# Altium schematic sheet Arak-AnalogueFrontend.SchDoc
size 431 x 279 mm; Date: Not shown in title block; ApprovedBy: Not shown in title block; CheckedBy: Not shown in title block; Author: Not shown in title block; CompanyName: Not shown in title block; Engineer: Not shown in title block; Organization: Not shown in title block; Address1: Not shown in title block; Address2: Not shown in title block; Address3: Not shown in title block; Address4: Not shown in title block; DocumentNumber: 6; Revision: Use project parameter SCH_Rev; SheetNumber: 6; SheetTotal: 11; PageSetup: Record=PageOptions|CenterHorizontal=True|CenterVertical=True|PrintScale=1.00|XCorrection=1.00|YCorrection=1.00|PrintKind=0|BorderSize=5000000|LeftOffset=0|BottomOffset=0|Orientation=2|PaperLength=1000|PaperWidth=1000|Scale=100|PaperSource=15|PrintQuality=600|MediaType=1|DitherType=10|PaperKind=Letter|PrintScaleMode=1; CurrentTime: Not shown in title block; CurrentDate: Not shown in title block; Time: Not shown in title block; DocumentFullPathAndName: Not shown in title block; DocumentName: Not shown in title block; ModifiedDate: Not shown in title block; ImagePath: Not shown in title block
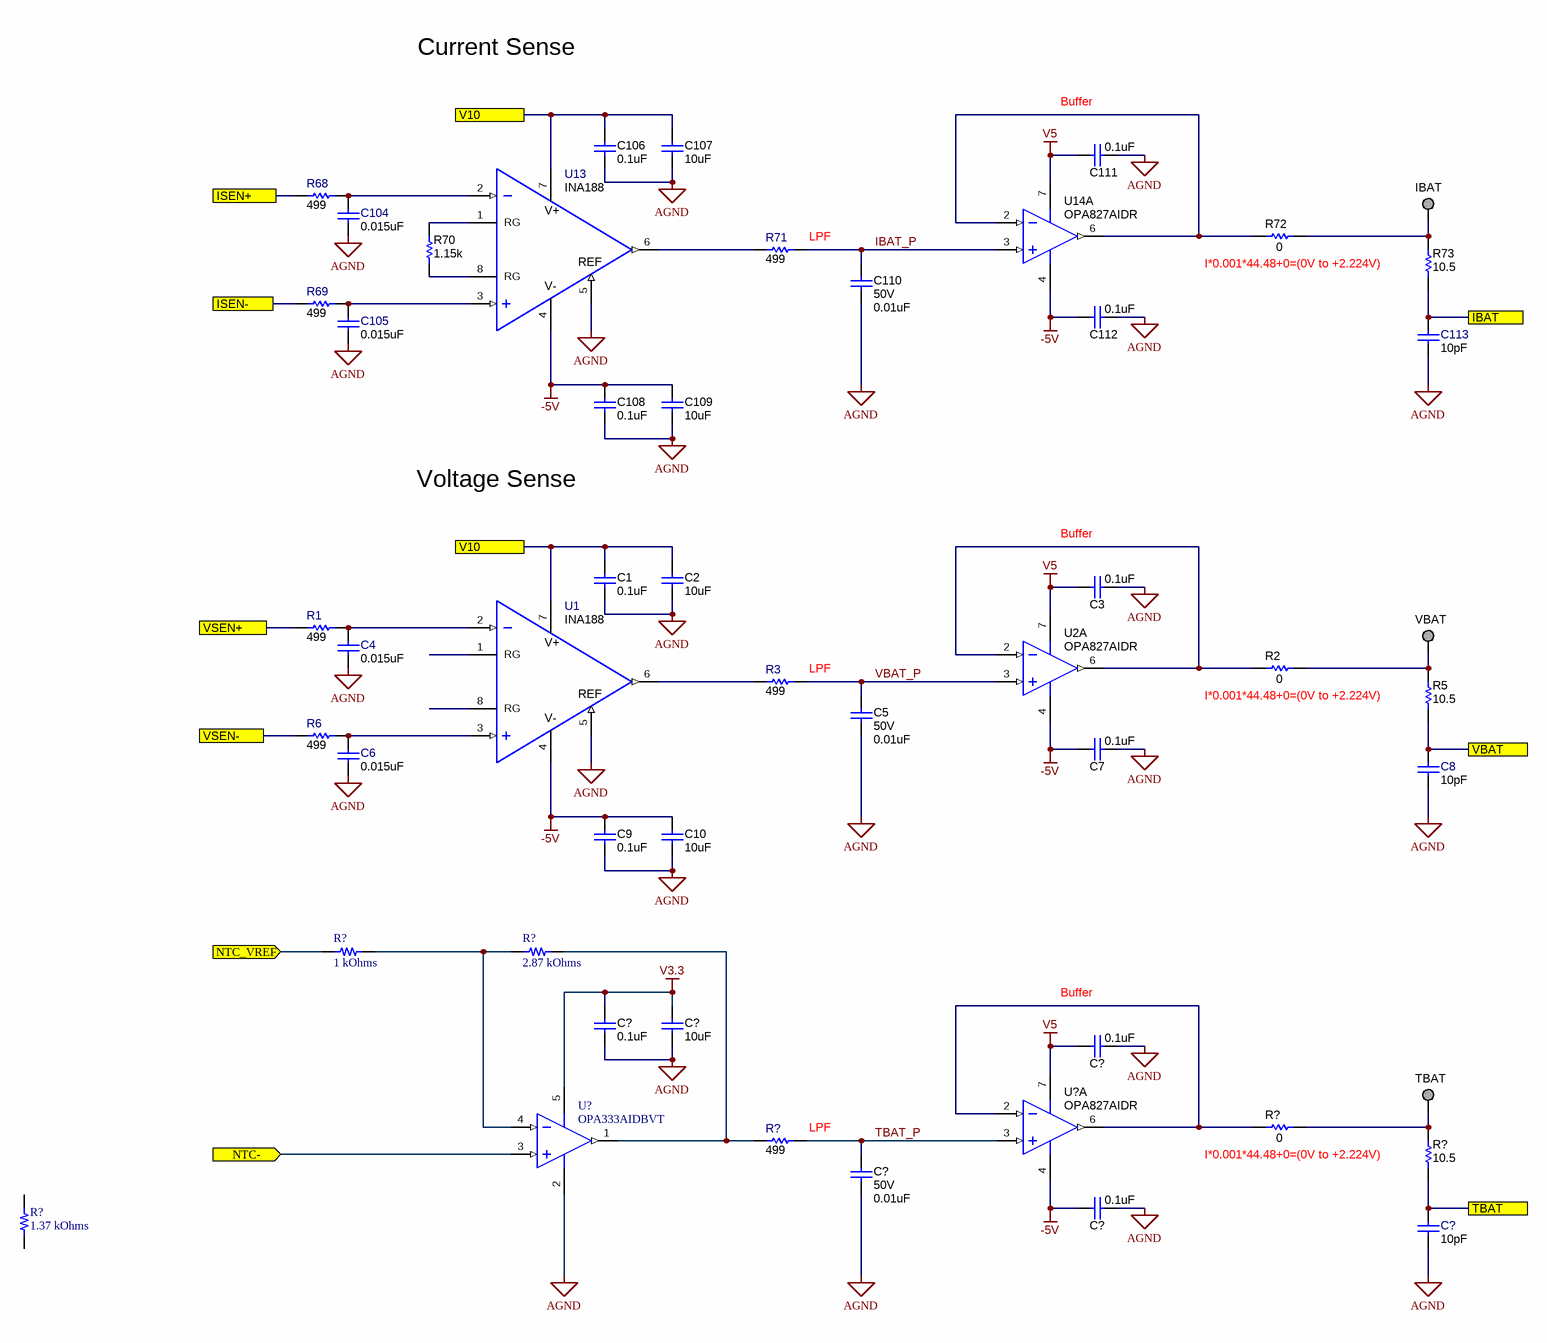
[diagram p0: Arak-AnalogueFrontend.SchDoc]

## Parts
(Parts that share a designator on the sheet are numbered #1, #2 ... from top to bottom, then left to right.)
C1  ValueDisplayed: 0.1uF  [0603]  (hidden comment: Capacitor)
C2  ValueDisplayed: 10uF  [0805_HV]  (hidden comment: Capacitor)
C3  ValueDisplayed: 0.1uF  [0603]  (hidden comment: Capacitor)
C4  ValueDisplayed: 0.015uF  [0603]  (hidden comment: Capacitor)
C5  VDC_V: 50V  ValueDisplayed: 0.01uF  [0603]  (hidden comment: GCM188R71H103KA37D)
C6  ValueDisplayed: 0.015uF  [0603]  (hidden comment: Capacitor)
C7  ValueDisplayed: 0.1uF  [0603]  (hidden comment: Capacitor)
C8  ValueDisplayed: 10pF  [0603]  (hidden comment: Capacitor)
C9  ValueDisplayed: 0.1uF  [0603]  (hidden comment: Capacitor)
C10  ValueDisplayed: 10uF  [0805_HV]  (hidden comment: Capacitor)
C104  ValueDisplayed: 0.015uF  [0603]  (hidden comment: Capacitor)
C105  ValueDisplayed: 0.015uF  [0603]  (hidden comment: Capacitor)
C106  ValueDisplayed: 0.1uF  [0603]  (hidden comment: Capacitor)
C107  ValueDisplayed: 10uF  [0805_HV]  (hidden comment: Capacitor)
C108  ValueDisplayed: 0.1uF  [0603]  (hidden comment: Capacitor)
C109  ValueDisplayed: 10uF  [0805_HV]  (hidden comment: Capacitor)
C110  VDC_V: 50V  ValueDisplayed: 0.01uF  [0603]  (hidden comment: GCM188R71H103KA37D)
C111  ValueDisplayed: 0.1uF  [0603]  (hidden comment: Capacitor)
C112  ValueDisplayed: 0.1uF  [0603]  (hidden comment: Capacitor)
C113  ValueDisplayed: 10pF  [0603]  (hidden comment: Capacitor)
C?#1  ValueDisplayed: 0.1uF  [0603]  (hidden comment: Capacitor)
C?#2  ValueDisplayed: 10uF  [0805_HV]  (hidden comment: Capacitor)
C?#3  ValueDisplayed: 0.1uF  [0603]  (hidden comment: Capacitor)
C?#4  VDC_V: 50V  ValueDisplayed: 0.01uF  [0603]  (hidden comment: GCM188R71H103KA37D)
C?#5  ValueDisplayed: 0.1uF  [0603]  (hidden comment: Capacitor)
C?#6  ValueDisplayed: 10pF  [0603]  (hidden comment: Capacitor)
IBAT  Pogo Pad  [PogoPad]  (value not drawn)  (no BOM)
R1  ValueDisplayed: 499  [0603]  (hidden comment: Resistor)
R2  ValueDisplayed: 0  [0603]  (hidden comment: Resistor)
R3  ValueDisplayed: 499  [0603]  (hidden comment: Resistor)
R5  ValueDisplayed: 10.5  [0603]  (hidden comment: RC0603FR-0710R5L)
R6  ValueDisplayed: 499  [0603]  (hidden comment: Resistor)
R68  ValueDisplayed: 499  [0603]  (hidden comment: Resistor)
R69  ValueDisplayed: 499  [0603]  (hidden comment: Resistor)
R70  1.15k  [0603]
R71  ValueDisplayed: 499  [0603]  (hidden comment: Resistor)
R72  ValueDisplayed: 0  [0603]  (hidden comment: Resistor)
R73  ValueDisplayed: 10.5  [0603]  (hidden comment: RC0603FR-0710R5L)
R?#1  1 kOhms  [RES 0603_1608]
R?#2  2.87 kOhms  [RES 0603_1608]
R?#3  ValueDisplayed: 0  [0603]  (hidden comment: Resistor)
R?#4  ValueDisplayed: 499  [0603]  (hidden comment: Resistor)
R?#5  ValueDisplayed: 10.5  [0603]  (hidden comment: RC0603FR-0710R5L)
R?#6  1.37 kOhms  [RES 0603_1608]
TBAT  Pogo Pad  [PogoPad]  (value not drawn)  (no BOM)
U1  INA188  [D0008A_N]
U2  OPA827AIDR  [D0008A_L]  (part A of 2)
U13  INA188  [D0008A_N]
U14  OPA827AIDR  [D0008A_L]  (part A of 2)
U?#1  OPA827AIDR  [D0008A_L]  (part A of 2)
U?#2  OPA333AIDBVT  [DBV0005A_M]
VBAT  Pogo Pad  [PogoPad]  (value not drawn)  (no BOM)

## Ports
IBAT, ISEN+, ISEN-, NTC- (in), NTC_VREF (in), TBAT, V10, VBAT, VSEN+, VSEN-

## Nets
-5V: C7.1 C9.1 C10.1 C108.1 C109.1 C112.1 C?#5.1 U1.4(V-) U2.4(V-) U13.4(V-) U14.4(V-) U?#1.4(V-)
AGND: C1.2 C2.2 C3.2 C4.2 C5.2 C6.2 C7.2 C8.1 C9.2 C10.2 C104.2 C105.2 C106.2 C107.2 C108.2 C109.2 C110.2 C111.2 C112.2 C113.1 C?#1.2 C?#2.2 C?#3.2 C?#4.2 C?#5.2 C?#6.1 U1.5(REF) U13.5(REF) U?#2.2(V-)
V3.3: C?#1.1 C?#2.1 U?#2.5(V+)
V5: C3.1 C111.1 C?#3.1 U2.7(V+) U14.7(V+) U?#1.7(V+)
IBAT: C113.2 R73.1 ; port IBAT
IBAT_P: C110.1 R71.1 U14.3(IN+)
ISEN+: R68.2 ; port ISEN+
ISEN-: R69.2 ; port ISEN-
NTC-: U?#2.3(IN+) ; port NTC-
NTC_VREF: R?#1.1 ; port NTC_VREF
TBAT: C?#6.2 R?#5.1 ; port TBAT
TBAT_P: C?#4.1 R?#4.1 U?#1.3(IN+)
V10: C1.1 C2.1 C106.1 C107.1 U1.7(V+) U13.7(V+) ; port V10
VBAT: C8.2 R5.1 ; port VBAT
VBAT_P: C5.1 R3.1 U2.3(IN+)
VSEN+: R1.2 ; port VSEN+
VSEN-: R6.2 ; port VSEN-
NetC4_1: C4.1 R1.1 U1.2(IN-)
NetC6_1: C6.1 R6.1 U1.3(IN+)
NetC104_1: C104.1 R68.1 U13.2(IN-)
NetC105_1: C105.1 R69.1 U13.3(IN+)
NetIBAT_1: IBAT.1 R72.2 R73.2
NetR2_1: R2.1 U2.2(IN-) U2.6(OUT)
NetR2_2: R2.2 R5.2 VBAT.1
NetR3_2: R3.2 U1.6(OUT)
NetR70_1: R70.1 U13.8(RG)
NetR70_2: R70.2 U13.1(RG)
NetR71_2: R71.2 U13.6(OUT)
NetR72_1: R72.1 U14.2(IN-) U14.6(OUT)
NetR?#1_2: R?#1.2 R?#2.1 U?#2.4(IN-)
NetR?#2_2: R?#2.2 R?#4.2 U?#2.1(OUT)
NetR?#3_1: R?#3.1 U?#1.2(IN-) U?#1.6(OUT)
NetR?#3_2: R?#3.2 R?#5.2 TBAT.1

Not connected (* = marked no-connect by the designer): R?#6 1 2; U1 1(RG) 8(RG)

## Notes on the sheet
- Current Sense
- (near C111) Buffer
- (near R71) LPF
- (near R72) I*0.001*44.48+0=(0V to +2.224V)
- Voltage Sense
- (near C3) Buffer
- (near R3) LPF
- (near R2) I*0.001*44.48+0=(0V to +2.224V)
- (near C?#3) Buffer
- (near R?#4) LPF
- (near R?#3) I*0.001*44.48+0=(0V to +2.224V)
- Drawn By:
- SVN Rev:
- Number:
- TID #:
- Orderable:
- Rev:
- Sheet Title:
- File:
- Project Title:
- Designed for:
- Assembly Variant:
- Mod. Date:
- Sheet:
- Size:
- of
- B
- http://www.ti.com
- Texas Instruments and/or its licensors do not warrant the accuracy or completeness of this specification or any information contained therein. Texas Instruments and/or its licensors do not warrant that this design will meet the specifications, will be suitable for your application or fit for any particular purpose, or will operate in an implementation. Texas Instruments and/or its licensors do not warrant that the design is production worthy. You should completely validate and test your design implementation to confirm the system functionality for your application.
- Engineer:
- Contact:
- © Texas Instruments

## Library data of the parts
C1 C3 C7 C9 C106 C108 C111 C112 C?#1 C?#3 C?#5 = CMP-0006752-5: CAP, CERM, 0.1 uF, 25 V, +/- 5%, X7R, 0603; PartNumber: 06033C104JAT2A; Manufacturer: AVX; Polarized: N; Value: 0.1uF; U/M: EA; Cap_F: 100nF; ESR_ohm: 0.05; Value1: 0.05 ohm; VDC_V: 25V; TaMin_C: -55°C; TaMax_C: 125°C; AEC Category: Q200; SizeArea_mm2: 1.28; SizeAreaWB_mm2: 4.68; SizeX_mm: 1.6; SizeY_mm: 0.8; SizeZ_mm: 1; CompType: Capacitor; PackageReference: 0603; RoHS: Y; Tolerance_%: 5%; Value2: 25V; MountType: SMT; Technology: Ceramic; TempCo: X7R; Cap_Case: 0603; Published: 2008-06-19; Publisher: Texas Instruments; LatestRevisionDate: 2017-03-09; ComponentLink1Description: Datasheet link; ComponentLink1URL: http://datasheets.avx.com/X7RDielectric.pdf; Supplier 1: Digi-Key; Supplier Part Number 1: 478-3713-1-ND; Supplier 2: Mouser; Supplier Part Number 2: 581-06033C104JAT2A; Supplier 3: Farnell; Supplier Part Number 3: 1740614; AEC Qualified: N; AEC Grade: N/A
C2 C10 C107 C109 C?#2 = CMP-0008315-2: CAP, CERM, 10 uF, 10 V, +/- 10%, X7R, 0805; PartNumber: GRM21BR71A106KE51L; Manufacturer: MuRata; Polarized: N; Value: 10uF; U/M: EA; Cap_F: 10µF; ESR_ohm: 3m; Value1: 0.003 ohm; VDC_V: 10V; TaMin_C: -55°C; TaMax_C: 125°C; Cap_Case: 0805; AEC Category: Q200; SizeArea_mm2: 2.5; SizeAreaWB_mm2: 6.75; SizeX_mm: 2; SizeY_mm: 1.25; SizeZ_mm: 1.45; CompType: Capacitor; PackageReference: 0805; RoHS: Y; Tolerance_%: 10%; Value2: 10V; MountType: SMT; Technology: Ceramic; TempCo: X7R; Published: 2008-06-19; Publisher: Texas Instruments; LatestRevisionDate: 2017-03-09; ComponentLink1Description: Datasheet link; ComponentLink1URL: http://search.murata.co.jp/Ceramy/PnsearchViewAction.do?HnOFG=ON&HnNFG=ON&SEL_CNT=50&sLang=en&sKey=GRM21BR71A106KE51L&x=9&y=9&search=startwith; Supplier 1: Digi-Key; Supplier Part Number 1: 490-3905-1-ND; Supplier 2: Mouser; Supplier Part Number 2: 81-GRM21BR71A106KE51; Supplier 3: Farnell; Supplier Part Number 3: 1828828; AEC Qualified: ?
C4 C6 C104 C105 = CMP-0007383-5: CAP, CERM, 0.015 uF, 16 V, +/- 10%, X7R, 0603; PartNumber: GRM188R71C153KA01D; Manufacturer: MuRata; Polarized: N; U/M: EA; Cap_F: 15nF; Value1: Unknown; VDC_V: 16V; TaMin_C: -55°C; TaMax_C: 125°C; SizeArea_mm2: 1.28; SizeAreaWB_mm2: 4.68; SizeX_mm: 1.6; SizeY_mm: 0.8; SizeZ_mm: 1; AEC Category: Q200; CompType: Capacitor; Value: 0.015uF; PackageReference: 0603; RoHS: Y; Tolerance_%: 10%; Value2: 16V; MountType: SMT; Technology: Ceramic; TempCo: X7R; Cap_Case: 0603; Published: 2008-06-19; Publisher: Texas Instruments; LatestRevisionDate: 2017-03-09; ComponentLink1Description: Datasheet link; ComponentLink1URL: http://search.murata.co.jp/Ceramy/PnsearchViewAction.do?HnOFG=ON&HnNFG=ON&SEL_CNT=50&sLang=en&sKey=GRM188R71C153KA01D&x=9&y=9&search=startwith; Supplier 1: Mouser; Supplier Part Number 1: 81-GRM188R71C153KA; AEC Qualified: ?
C5 C110 C?#4 = CMP-0007143-4: CAP, CERM, 0.01 uF, 50 V, +/- 10%, X7R, AEC-Q200 Grade 1, 0603; Manufacturer: MuRata; TaMin_C: -55°C; Polarized: N; SizeAreaWB_mm2: 4.68; Value1: Unknown; U/M: EA; Value: 0.01uF; TaMax_C: 125°C; SizeZ_mm: 1; SizeX_mm: 1.6; SizeY_mm: 0.8; SizeArea_mm2: 1.28; CompType: Capacitor; AEC Qualified: Y; Cap_F: 10nF; AEC Category: Q200; Supplier Part Number 2: 45Y5166; Publisher: Texas Instruments; Supplier 2: Newark; Supplier Part Number 3: 81-GCM188R71H103KA7D; TempCo: X7R; Supplier 3: Mouser; Published: 2008-06-19; RoHS: Y; MountType: SMT; Supplier 1: Digi-Key; PackageReference: 0603; Tolerance_%: 10%; Cap_Case: 0603; Value2: 50V; LatestRevisionDate: 2017-03-09; PartNumber: GCM188R71H103KA37D; ComponentLink1Description: Datasheet link; AEC Grade: 1; Supplier Part Number 1: 490-4778-1-ND; Technology: Ceramic; ComponentLink1URL: http://psearch.en.murata.com/capacitor/product/GCM188R71H103KA37%23.pdf
C8 C113 C?#6 = CMP-0007170-4: CAP, CERM, 10 pF, 50 V, +/- 5%, C0G/NP0, 0603; PartNumber: GRM1885C1H100JA01D; Manufacturer: MuRata; Polarized: N; Value: 10pF; U/M: EA; Value1: Unknown; VDC_V: 50V; TaMin_C: -55°C; TaMax_C: 125°C; SizeArea_mm2: 1.28; SizeAreaWB_mm2: 4.68; SizeX_mm: 1.6; SizeY_mm: 0.8; SizeZ_mm: 1; AEC Category: Q200; CompType: Capacitor; PackageReference: 0603; RoHS: Y; Cap_F: 10pF; Tolerance_%: 5%; Value2: 50V; MountType: SMT; Technology: Ceramic; TempCo: C0G/NP0; Cap_Case: 0603; Published: 2008-06-19; Publisher: Texas Instruments; LatestRevisionDate: 2017-03-09; ComponentLink1Description: Datasheet link; ComponentLink1URL: http://search.murata.co.jp/Ceramy/PnsearchViewAction.do?HnOFG=ON&HnNFG=ON&SEL_CNT=50&sLang=en&sKey=GRM1885C1H100JA01D&x=9&y=9&search=startwith; Supplier 1: Digi-Key; Supplier Part Number 1: 490-1403-1-ND; Supplier 2: Mouser; Supplier Part Number 2: 81-GRM39C100D50; Supplier 3: Farnell; Supplier Part Number 3: 8819815; AEC Qualified: ?
IBAT TBAT VBAT = PogoPad: Pad for Pogo Pin Connector; SymbolCreator: codlsc; SymbolVersion: 2010-09-27; PackageReference: N/A; CompType: Pogo Pad; Publisher: Texas Instruments; LatestRevisionDate: 2016-12-05; LatestRevisionNote: Added Alternate PartNumber and Alternate Manufacturer parameters to appropriate components.
R1 R3 R6 R68 R69 R71 R?#4 = CMP-0022446-5: RES, 499, 1%, 0.1 W, AEC-Q200 Grade 0, 0603; PartNumber: CRCW0603499RFKEA; Manufacturer: Vishay-Dale; Value: 499; Value_Code: 499R; Power_W: 100mW; Value2: 0.1W; VDC_V: 75V; TempCo: 100 ppm/C; SizeArea_mm2: 1.28; SizeX_mm: 1.6; SizeY_mm: 0.8; SizeZ_mm: 1; EIA_Code: E96; AEC Category: Q200; AEC Qualified: Y; AEC Grade: 0; CompType: Resistor; PackageReference: 0603; RoHS: E; Res_ohm: 499; Tolerance_%: 1%; Value1: 1%; MountType: SMT; Technology: Thick Film; ComponentLink1Description: Datasheet link; ComponentLink1URL: http://www.vishay.com/docs/20035/dcrcwe3.pdf; Supplier 1: Digi-Key; Supplier Part Number 1: 541-499HCT-ND; Supplier 2: Newark; Supplier Part Number 2: 52K8569; Supplier 3: Mouser; Supplier Part Number 3: 71-CRCW0603-499-E3
R2 R72 R?#3 = CMP-0025874-3: RES, 0, 5%, 0.1 W, 0603; PartNumber: ERJ-3GEY0R00V; Manufacturer: Panasonic; Value: 0; Value_Code: 0000; Power_W: 100mW; Value2: 0.1W; VDC_V: 50V; TempCo: 600 ppm/C; EIA_Code: E24; U/M: EA; AEC Category: Q200; SizeArea_mm2: 1.28; SizeX_mm: 1.6; SizeY_mm: 0.8; SizeZ_mm: 1; CompType: Resistor; PackageReference: 0603; RoHS: Y; Res_ohm: 0; Tolerance_%: 5%; Value1: 5%; MountType: SMT; Technology: Thick Film; Published: 2008-06-26; Publisher: Texas Instruments; LatestRevisionDate: 2017-03-09; ComponentLink1Description: Datasheet link; ComponentLink1URL: http://www.panasonic.com/industrial/components/pdf/AOA0000CE1.pdf; Supplier 1: Digi-Key; Supplier Part Number 1: P0.0GCT-ND; Supplier 2: Mouser; Supplier Part Number 2: 667-ERJ-3GEY0R00V; Supplier 3: Farnell; Supplier Part Number 3: 2059527; AEC Qualified: ?
R5 R73 R?#5 = CMP-0022749-2: RES, 10.5, 1%, 0.1 W, 0603; Manufacturer: Yageo America; Power_W: 100mW; TempCo: 200 ppm/C; Value_Code: 10R5; U/M: EA; Value: 10.5; EIA_Code: E96; SizeX_mm: 1.6; SizeY_mm: 0.8; SizeZ_mm: 1; Value2: 0.1W; SizeArea_mm2: 1.28; CompType: Resistor; VDC_V: 150V; AEC Category: Q200; ComponentLink1URL: http://www.yageo.com/pdf/Pu-RC0603_51_PbFree_L_2.pdf; Supplier Part Number 2: 603-RC0603FR-0710R5L; Publisher: Texas Instruments; Supplier 2: Mouser; Supplier Part Number 3: 9238247; Supplier 3: Farnell; Published: 2008-06-26; RoHS: Y; Value1: 1%; MountType: SMT; Supplier 1: Digi-Key; PackageReference: 0603; Tolerance_%: 1%; Res_ohm: 10.5; LatestRevisionDate: 2017-03-09; PartNumber: RC0603FR-0710R5L; AEC Qualified: ?; ComponentLink1Description: Datasheet link; Supplier Part Number 1: 311-10.5HRCT-ND; Technology: Thick Film
R70 = CMP-0023872-3: RES, 1.15 k, 0.1%, 0.1 W, 0603; Manufacturer: Yageo America; PartNumber: RT0603BRD071K15L; Power_W: 100mW; TempCo: 25 ppm/C; Value_Code: 1k15; U/M: EA; EIA_Code: E192; SizeX_mm: 1.6; SizeY_mm: 0.8; SizeZ_mm: 1; SizeArea_mm2: 1.28; CompType: Resistor; Value2: 0.1W; VDC_V: 75V; AEC Category: Q200; Publisher: Texas Instruments; Published: 2008-06-26; RoHS: Y; Value1: 0.1%; MountType: SMT; Value: 1.15k; PackageReference: 0603; Tolerance_%: 0.1%; Res_ohm: 1.15k; LatestRevisionDate: 2017-03-09; AEC Qualified: ?; ComponentLink1Description: Datasheet link; Technology: Thin Film; ValueDisplayed: 1.15k; ComponentLink1URL: http://www.yageo.com/pdf/PYu-RT_1-to-0.05_RoHS_L_3.pdf
R?#1 = TNPW06031K00BYEN: RES 1K OHM 0.1% 1/8W 0603; Manufacturer: Vishay Dale; Power (Watts): 0.125W, 1/8W; Temperature Coefficient: ±10ppm/°C; Part Number: TNPW06031K00BYEN; Value: 1 kOhms; ComponentLink1Description: Datasheet; ComponentLink1URL: http://www.vishay.com/docs/28758/tnpw_e3.pdf; ComponentLink2Description: DigiKey Link; ComponentLink2URL: http://digikey.com/product-detail/en/vishay-dale/TNPW06031K00BYEN/541-4408-1-ND/8629044; Composition: Thin Film; Device Package: 0603 (1608 Metric); Features: Anti-Sulfur, Automotive AEC-Q200, Moisture Resistant; Height - Seated (Max): 0.022" (0.55mm); LastUpdated: 21/01/2020 12:18:21 AM; Lifecycle Status: Active; Minimum Order: 1; Number of Terminations: 2; Operating Temperature: -55°C ~ 155°C; Package / Case: 0603 (1608 Metric); Packaging: TapeAndReel; PartId: 21027; Part Status: Active; Price: 0.27; Ratings: AEC-Q200; Resistance: 1 kOhms; Series: TNPW e3; Size / Dimension: 0.061" L x 0.033" W (1.55mm x 0.85mm); Supplier 1: DigiKey; Supplier Part Number 1: 541-4408-1-ND; Supplier Device Package: 0603; Tolerance: ±0.1%
R?#2 = TNPW06032K87BEEA: RES 2.87K OHM 0.1% 1/8W 0603; Manufacturer: Vishay Dale; Power (Watts): 0.125W, 1/8W; Temperature Coefficient: ±25ppm/°C; Part Number: TNPW06032K87BEEA; Value: 2.87 kOhms; ComponentLink1Description: Datasheet; ComponentLink1URL: http://www.vishay.com/docs/28758/tnpw_e3.pdf; ComponentLink2Description: DigiKey Link; ComponentLink2URL: http://digikey.com/product-detail/en/vishay-dale/TNPW06032K87BEEA/541-3180-1-ND/6532822; Composition: Thin Film; Device Package: 0603 (1608 Metric); Features: Anti-Sulfur, Automotive AEC-Q200, Moisture Resistant; Height - Seated (Max): 0.022" (0.55mm); LastUpdated: 21/01/2020 12:17:06 AM; Lifecycle Status: Active; Minimum Order: 1; Number of Terminations: 2; Operating Temperature: -55°C ~ 155°C; Package / Case: 0603 (1608 Metric); Packaging: TapeAndReel; PartId: 23190; Part Status: Active; Price: 0.11; Ratings: AEC-Q200; Resistance: 2.87 kOhms; Series: TNPW e3; Size / Dimension: 0.063" L x 0.033" W (1.60mm x 0.85mm); Supplier 1: DigiKey; Supplier Part Number 1: 541-3180-1-ND; Supplier Device Package: 0603; Tolerance: ±0.1%
R?#6 = TNPW06031K37BEEA: RES 1.37K OHM 0.1% 1/8W 0603; Manufacturer: Vishay Dale; Power (Watts): 0.125W, 1/8W; Temperature Coefficient: ±25ppm/°C; Part Number: TNPW06031K37BEEA; Value: 1.37 kOhms; ComponentLink1Description: Datasheet; ComponentLink1URL: http://www.vishay.com/docs/28758/tnpw_e3.pdf; ComponentLink2Description: DigiKey Link; ComponentLink2URL: http://digikey.com/product-detail/en/vishay-dale/TNPW06031K37BEEA/541-3048-1-ND/6073691; Composition: Thin Film; Device Package: 0603 (1608 Metric); Features: Anti-Sulfur, Automotive AEC-Q200, Moisture Resistant; Height - Seated (Max): 0.022" (0.55mm); LastUpdated: 21/01/2020 12:14:57 AM; Lifecycle Status: Active; Minimum Order: 1; Number of Terminations: 2; Operating Temperature: -55°C ~ 155°C; Package / Case: 0603 (1608 Metric); Packaging: TapeAndReel; PartId: 25753; Part Status: Active; Price: 0.11; Ratings: AEC-Q200; Resistance: 1.37 kOhms; Series: TNPW e3; Size / Dimension: 0.063" L x 0.033" W (1.60mm x 0.85mm); Supplier 1: DigiKey; Supplier Part Number 1: 541-3048-1-ND; Supplier Device Package: 0603; Tolerance: ±0.1%
U1 U13 = CMP-0075744-1: 36-V, Zero-Drift, Rail-to-Rail-Out Instrumentation Amplifier, D0008A (SOIC-8); PartNumber: INA188IDR; Alternate PartNumber: INA188ID; Manufacturer: Texas Instruments; SizeArea_mm2: 30.38; SizeAreaWB_mm2: 56.58; SizeX_mm: 4.9; SizeY_mm: 6.2; SizeZ_mm: 1.75; CompType: IC; U/M: EA; PackageReference: D0008A; PackageDescription: SOIC-8; MountType: SMT; ComponentLink1Description: Datasheet Link; ComponentLink1URL: http://www.ti.com/lit/ds/symlink/ina188.pdf; RoHS: Y; Publisher: Texas Instruments; LatestRevisionDate: 2017-06-09; Alternate Manufacturer: Texas Instruments
U2 U14 U?#1 = CMP-0041267-2: Low-Noise, High-Precision, JFET-Input Operational Amplifier, 8 to 36 V, -40 to 125 degC, 8-pin SOIC (D8), Green (RoHS & no Sb/Br); Manufacturer: Texas Instruments; Vmax(V): 36; GBW(Typ)(MHz): 22; Vmin(V): 8; Iq per channel(Max)(mA): 5.2; SubFamily: Audio Operational Amplifier; Number of Channels: 1; Vn at Flatband(Typ)(nV/rtHz): 4; ComponentLink1URL: http://www.ti.com/; Code_JEDEC: MS-012; PackageDescription: 8-Pin Plastic Small Outline, Body 4.9 x 3.9 mm, Pitch 1.27 mm; ComponentLink2URL: http://www.ti.com/general/docs/lit/getliterature.tsp?genericPartNumber=OPA827&fileType=pdf; ComponentLink3Description: Package Specification; Eco-Plan: Green (RoHS & no Sb/Br); ComponentLink2Description: Datasheet; ComponentLink3URL: http://www.ti.com/litv/pdf/msoi002j; PackageReference: D0008A; DatasheetVersion: SBOS376H; PartNumber: OPA827AIDR; PackageVersion: 4040047-3/M, 06/2011; Mounting Technology: Surface Mount; ComponentLink1Description: Manufacturer URL
U?#2 = CMP-0272-00841-3: 17 uA, MicroPower, Precision, Zero Drift CMOS Operational Amplifier, 1.8 to 5.5 V, -40 to 125 degC, 5-pin SOT23 (DBV5), Green (RoHS & no Sb/Br); Manufacturer: Texas Instruments; Vio (25C)(Max)(mV): 0.01; Sub Family: Low Offset Voltage Amplifier (<=500uV), Low Power Amp (<=500uA), Low Supply Voltage Amplifier (<=2.7V), Precision Amplifier, Zero Drift Precision Amplifier; Iq per channel(Max)(mA): 0.025; CMRR(Min)(dB): 106; Total Supply Voltage(Max)(+5V is 5, +/-5V is 10): 5.5; Number of Channels: 1; Total Supply Voltage(Min)(+5V is 5, +/-5V is 10): 1.8; Slew Rate(Typ)(V/us): 0.16; IIB(Max)(pA): 200; Offset Drift(Typ)(uV/C): 0.02; PackageDescription: 5-Pin Plastic Small Outline, Body 1.6 x 2.9 mm, Pitch 0.95 mm; DatasheetVersion: SBOS351C; ComponentLink1Description: Manufacturer URL; ComponentLink1URL: http://www.ti.com/; ComponentLink3URL: http://www.ti.com/litv/pdf/mpds018i; Code_JEDEC: MO-178; ComponentLink3Description: Package Specification; PackageVersion: 4073253-4/K, 03/2006; PackageReference: DBV0005A; ComponentLink2URL: http://www.ti.com/general/docs/lit/getliterature.tsp?genericPartNumber=OPA333&fileType=pdf; ComponentLink2Description: Datasheet; PartNumber: OPA333AIDBVT; Eco-Plan: Green (RoHS & no Sb/Br); Mounting Technology: Surface Mount